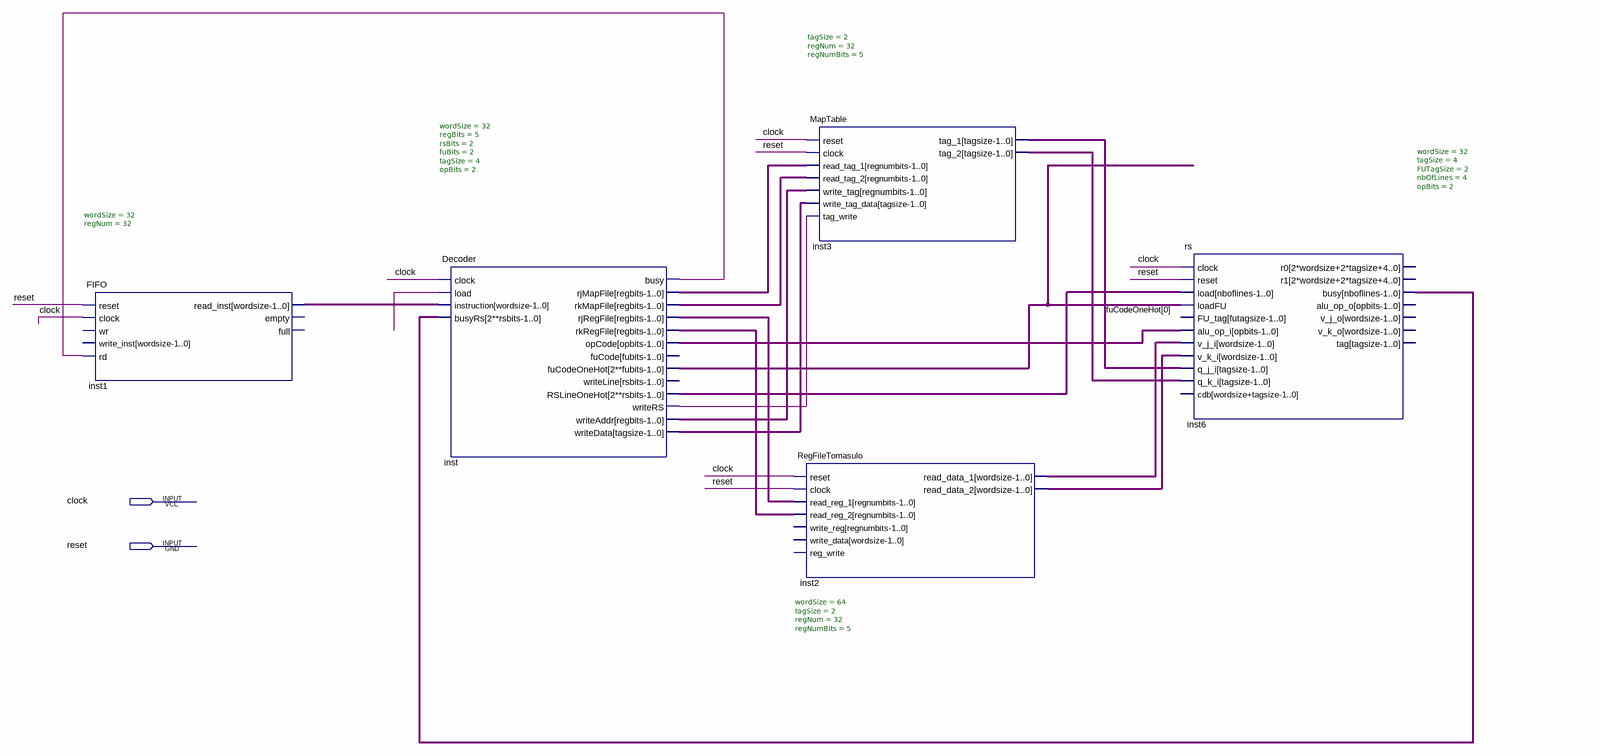
[diagram p0: schematic sheet]
// Quartus schematic Completo.bdf as structural Verilog: 5 symbols, 2 pins
module Completo (
  input  clock,
  input  reset
);

  wire inst_busy, inst_writers, undriven;
  wire [0:0] fuCodeOneHot;
  wire [1:0] inst_opcode;
  wire [3:0] inst3_tag_1, inst3_tag_2, inst6_busy, inst_rslineonehot, inst_writedata;
  wire [4:0] inst_rjmapfile, inst_rjregfile, inst_rkmapfile, inst_rkregfile, inst_writeaddr;
  wire [31:0] inst1_read_inst;
  wire [63:0] inst2_read_data_1, inst2_read_data_2;

  FIFO #(.wordSize(32), .regNum(32)) inst1 (
    .reset(reset), .clock(clock), .rd(inst_busy), .read_inst(inst1_read_inst));  // open: wr, write_inst, empty, full
  Decoder #(.wordSize(32), .regBits(5), .rsBits(2), .fuBits(2), .tagSize(4), .opBits(2)) inst (
    .clock(clock), .load(undriven), .instruction(inst1_read_inst), .busyRs(inst6_busy), .busy(inst_busy),
    .rjMapFile(inst_rjmapfile), .rkMapFile(inst_rkmapfile), .rjRegFile(inst_rjregfile),
    .rkRegFile(inst_rkregfile), .opCode(inst_opcode), .fuCodeOneHot(fuCodeOneHot[0]),
    .RSLineOneHot(inst_rslineonehot), .writeRS(inst_writers), .writeAddr(inst_writeaddr),
    .writeData(inst_writedata));  // open: fuCode, writeLine
  MapTable #(.tagSize(2), .regNum(32), .regNumBits(5)) inst3 (
    .reset(clock), .clock(reset), .read_tag_1(inst_rjmapfile), .read_tag_2(inst_rkmapfile),
    .write_tag(inst_writeaddr), .write_tag_data(inst_writedata), .tag_write(inst_writers),
    .tag_1(inst3_tag_1), .tag_2(inst3_tag_2));
  RegFileTomasulo #(.wordSize(64), .tagSize(2), .regNum(32), .regNumBits(5)) inst2 (
    .reset(clock), .clock(reset), .read_reg_1(inst_rjregfile), .read_reg_2(inst_rkregfile),
    .read_data_1(inst2_read_data_1), .read_data_2(inst2_read_data_2));  // open: write_reg, write_data, reg_write
  rs #(.wordSize(32), .tagSize(4), .FUTagSize(2), .nbOfLines(4), .opBits(2)) inst6 (
    .clock(clock), .reset(reset), .load(inst_rslineonehot), .loadFU(fuCodeOneHot[0]), .alu_op_i(inst_opcode),
    .v_j_i(inst2_read_data_1), .v_k_i(inst2_read_data_2), .q_j_i(inst3_tag_1), .q_k_i(inst3_tag_2),
    .busy(inst6_busy));  // open: FU_tag, cdb, r0, r1, alu_op_o, v_j_o, v_k_o, tag
endmodule
